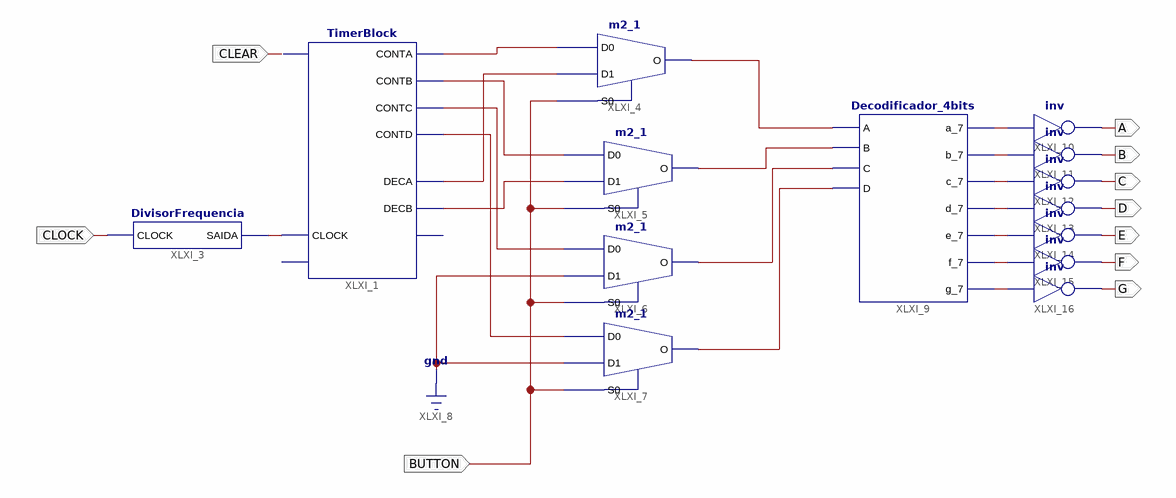
[diagram p0: schematic sheet 1]
// Xilinx ISE schematic test_timerblock.sch (spartan3) as structural Verilog: 14 symbols, 10 ports
module test_timerblock (
  input  CLOCK,
  input  CLEAR,
  input  BUTTON,
  output A,
  output B,
  output C,
  output D,
  output E,
  output F,
  output G
);

  wire XLXN_2, XLXN_3, XLXN_4, XLXN_5, XLXN_6, XLXN_7, XLXN_8, XLXN_11, XLXN_12, XLXN_13, XLXN_14, XLXN_15,
       XLXN_16, XLXN_17, XLXN_18, XLXN_19, XLXN_20, XLXN_21;

  TimerBlock XLXI_1 (
    .CLEAR(CLEAR), .CLOCK(XLXN_2), .CONTA(XLXN_3), .CONTB(XLXN_4), .CONTC(XLXN_5), .CONTD(XLXN_6),
    .DECA(XLXN_7), .DECB(XLXN_8));  // open: TIMEOUT, CE
  DivisorFrequencia XLXI_3 (.CLOCK(CLOCK), .SAIDA(XLXN_2));
  m2_1 XLXI_4 (.D0(XLXN_3), .D1(XLXN_7), .S0(BUTTON), .O(XLXN_11));
  m2_1 XLXI_5 (.D0(XLXN_4), .D1(XLXN_8), .S0(BUTTON), .O(XLXN_12));
  m2_1 XLXI_6 (.D0(XLXN_5), .D1(1'b0), .S0(BUTTON), .O(XLXN_13));
  m2_1 XLXI_7 (.D0(XLXN_6), .D1(1'b0), .S0(BUTTON), .O(XLXN_14));
  Decodificador_4bits XLXI_9 (
    .a_7(XLXN_15), .b_7(XLXN_16), .c_7(XLXN_17), .d_7(XLXN_18), .e_7(XLXN_19), .f_7(XLXN_20), .g_7(XLXN_21),
    .A(XLXN_11), .B(XLXN_12), .C(XLXN_13), .D(XLXN_14));
  not XLXI_10 (A, XLXN_15);
  not XLXI_11 (B, XLXN_16);
  not XLXI_12 (C, XLXN_17);
  not XLXI_13 (D, XLXN_18);
  not XLXI_14 (E, XLXN_19);
  not XLXI_15 (F, XLXN_20);
  not XLXI_16 (G, XLXN_21);
endmodule
